# Altium project STEVAL-ESLST25CB.PrjPcb
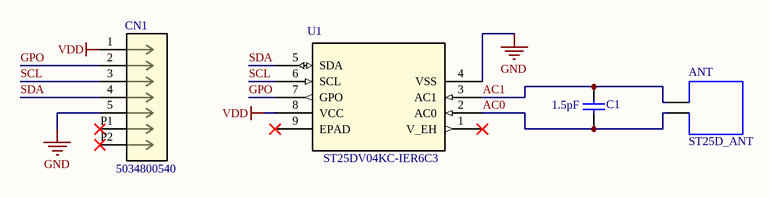
[diagram p0: STEVAL-ESLST25CB.SchDoc]
Board_Name: ST25 Antenna; Board_Reference: ESLST25CB; Board_PCB_Revision: A; Board_Document_Date: 1-July-2024; Board_Assembly_Revision: 1
1 sheet, 4 parts. Net scope: global (net labels, ports and power ports of the same name join across sheets).
Board file: STEVAL-ESLST25CB.PcbDoc

## Sheet STEVAL-ESLST25CB.SchDoc: STEVAL-ESLST25CB
size A; Date: Not used; ApprovedBy: Not used; CheckedBy: Not used; Author: Not used; CompanyName: STMicroelectronics; DrawnBy: Not used; Engineer: Not used; Organization: Not used; Address1: Not used; Address2: Not used; Address3: Not used; Address4: Not used; DocumentNumber: Not used; Revision: 1.0.0; SheetNumber: 1; SheetTotal: 1; CurrentTime: Not used; CurrentDate: Not used; Time: Not used; DocumentFullPathAndName: Not used; DocumentName: Not used; ModifiedDate: Not used; ImagePath: Not used; ProjectName: Not used; Application_BuildNumber: Not used

### Parts
ANT  ST25D_ANT  [ESL_NFC_ANT]
C1  value 1.5pF  [C0402]  (hidden comment: Capacitor)
CN1  5034800540  [CON_5034800540_MOL]
U1  ST25DV04KC-IER6C3  [UFDFPN8_STM]

### Nets
GND: CN1.5 U1.4(VSS)
VDD: CN1.1 U1.8(VCC)
AC0: ANT.2 C1.2 U1.2(AC0)
AC1: ANT.1 C1.1 U1.3(AC1)
GPO: CN1.2 U1.7(GPO)
SCL: CN1.3 U1.6(SCL)
SDA: CN1.4 U1.5(SDA)

Not connected (* = marked no-connect by the designer): CN1 P1* P2*; U1 1(V_EH)* 9(EPAD)*

### Notes on the sheet
- Title:
- Size:
- Date:
- A
- Revision:
- Sheet
- of
- File:

### Library data of the parts
ANT = ST25D_ANT: ST25D antenna
C1 = MCD-00003: Multilayer Ceramic Capacitor, 1.5 pF, 50 V, ± 0.1pF, C0G (NP0), 0402 [1005 Metric]; Manufacturer: Murata; Manufacturer Part Number: GJM1555C1H1R5BB01D; Material: 4241ConductorMaterial; ComponentLink1URL: http://tunmcdsvn.tun.st.com/Component_Documentation_Library/Trunk/Capacitor/YAGEO_NP0_Series; Supplier 1: Digikey; Supplier Part Number 1: 490-8087-1-ND; RoHS: Yes; Category: Ceramic Capacitors; Stock 1: 133157; Pricing 1: 1=0.17, 10=0.112, 50=0.067, 100=0.0527, 500=0.03896, 1000=0.03225, 2500=0.03002, 5000=0.02746 (USD); ComponentLink2URL: https://datasheet.ciiva.com/8030/1700191-8030107.pdf?src-supplier=Element14; ComponentLink2Description: https://datasheet.ciiva.com/8030/1700191-8030107.pdf?src-supplier=Element14; ComponentLink3URL: https://datasheet.ciiva.com/29542/partnumbering-e-01-29542725.pdf?src-supplier=Digikey; ComponentLink3Description: https://datasheet.ciiva.com/29542/partnumbering-e-01-29542725.pdf?src-supplier=Digikey; ComponentLink4URL: https://datasheet.ciiva.com/29542/partnumbering-e-01-29542726.pdf?src-supplier=Digikey; ComponentLink4Description: https://datasheet.ciiva.com/29542/partnumbering-e-01-29542726.pdf?src-supplier=Digikey
CN1 = 5034800540_5_circuits: Easy-On FFC/FPC Connector, 0.50mm Pitch, FBH1 Series, Right-Angle, Dual Contact, 1.00mm Height, 5 Circuits, Gold over Nickel Plating; Manufacturer: Molex Connector Corporation; Copyright: Copyright (C) 2023 Ultra Librarian. All rights reserved.; Manufacturer_Part_Number: 5034800540; RefDes: RefDes; Type: DEV; Manufacturer Part Number: 5034800540
U1 = ST25DV04K-IER6C3: NFC/RFID Tag and Transponder IC 13553kHz to 13567kHz 4Kbit 8-Pin UFDFPN T/R; Mfr_Name: STMicroelectronics; Copyright: Copyright (C) 2023 Ultra Librarian. All rights reserved.; Manufacturer_Part_Number: ST25DV04K-IER6C3; RefDes: RefDes; Type: DEV; Supplier 1: Mouser; Supplier Part Number 1: 511-ST25DV04K-IER6C3; Manufacturer: STMicroelectronics; Manufacturer Part Number: ST25DV04K-IER6C3; RoHS: Yes; Category: EEPROM; Stock 1: 3733; Pricing 1: 1=0.79, 10=0.718, 50=0.706, 100=0.646, 1000=0.616, 10000=0.563 (USD); ComponentLink1URL: https://datasheet.octopart.com/ST25DV04K-IER6C3-STMicroelectronics-datasheet-153441501.pdf?src-supplier=Element14; ComponentLink1Description: https://datasheet.octopart.com/ST25DV04K-IER6C3-STMicroelectronics-datasheet-153441501.pdf?src-supplier=Element14; ComponentLink2URL: https://datasheet.octopart.com/ST25DV04K-IER6C3-STMicroelectronics-datasheet-78834959.pdf?src-supplier=Future+Electronics; ComponentLink2Description: https://datasheet.octopart.com/ST25DV04K-IER6C3-STMicroelectronics-datasheet-78834959.pdf?src-supplier=Future+Electronics; ComponentLink3URL: https://www.st.com/resource/en/datasheet/st25dv04k.pdf?src-supplier=Digikey; ComponentLink3Description: https://www.st.com/resource/en/datasheet/st25dv04k.pdf?src-supplier=Digikey; ComponentLink4URL: http://www.st.com/content/ccc/resource/technical/document/datasheet/group3/74/20/c5/ca/b8/a1/41/e3/DM00167716/files/DM00167716.pdf/jcr:content/translations/en.DM00167716.pdf?src-supplier=Digikey; ComponentLink4Description: http://www.st.com/content/ccc/resource/technical/document/datasheet/group3/74/20/c5/ca/b8/a1/41/e3/DM00167716/files/DM00167716.pdf/jcr:content/translations/en.DM00167716.pdf?src-supplier=Digikey

## Assembly variants
VariantA: all parts fitted